# Altium schematic sheet ADCduinoModule_Power.SchDoc: Название платы
size 594 x 420 mm; ApprovedBy: Рогов; CheckedBy: Фамилия проверяющего; DrawnBy: Фамилия разработчика; DocumentNumber: Введите номер платы + Э3; SheetNumber: пусто если листов 1, иначе 1; SheetTotal: количество листов; Format: A2; DocumentType: тип схемы; Title1str: (вторая строка при необходимости); ImagePath: Введите номер платы
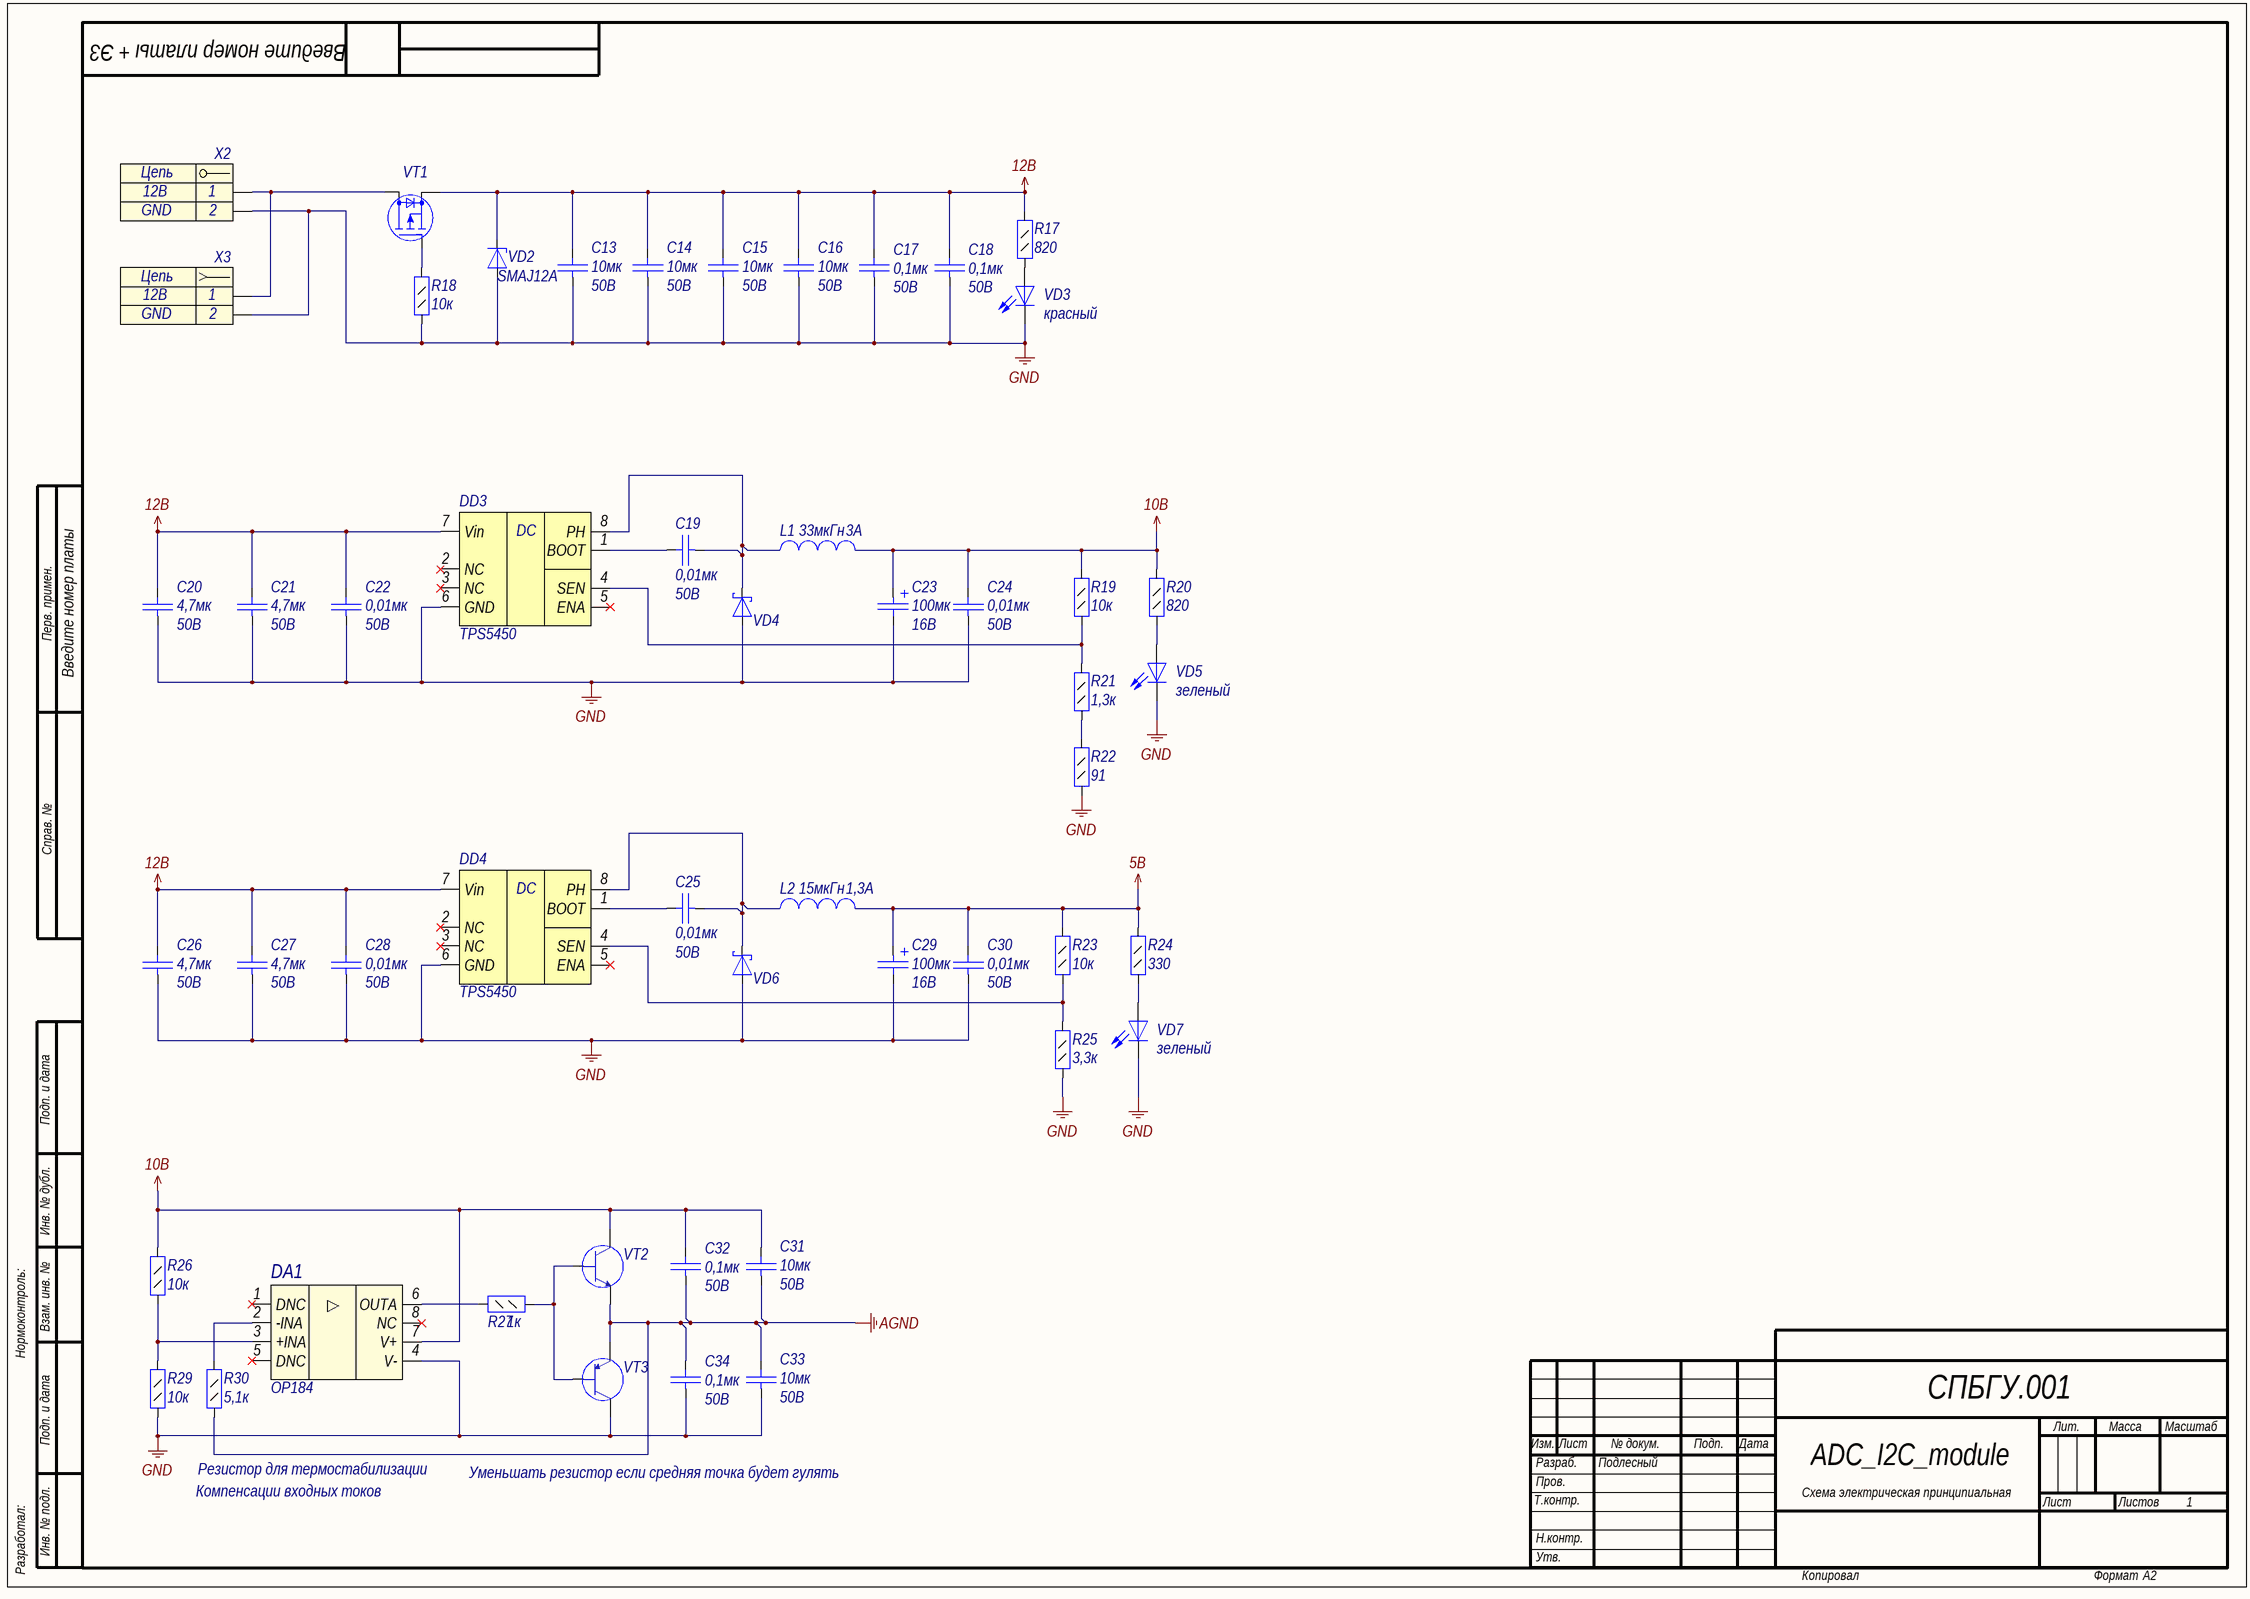
[diagram p0: ADCduinoModule_Power.SchDoc]

## Parts
C13  value 10мк  Voltage: 50В  [C1210]  (hidden comment: Capacitor)
C14  value 10мк  Voltage: 50В  [C1210]  (hidden comment: Capacitor)
C15  value 10мк  Voltage: 50В  [C1210]  (hidden comment: Capacitor)
C16  value 10мк  Voltage: 50В  [C1210]  (hidden comment: Capacitor)
C17  value 0,1мк  Voltage: 50B  [C0805]  (hidden comment: Capacitor)
C18  value 0,1мк  Voltage: 50B  [C0805]  (hidden comment: Capacitor)
C19  value 0,01мк  Voltage: 50B  [C0805]  (hidden comment: Capacitor)
C20  value 4,7мк  Voltage: 50В  [C1206]  (hidden comment: Capacitor)
C21  value 4,7мк  Voltage: 50В  [C1206]  (hidden comment: Capacitor)
C22  value 0,01мк  Voltage: 50B  [C0805]  (hidden comment: Capacitor)
C23  value 100мк  Voltage: 16В  [TANTAL CASE D]  (hidden comment: Capacitor_pol)
C24  value 0,01мк  Voltage: 50B  [C0805]  (hidden comment: Capacitor)
C25  value 0,01мк  Voltage: 50B  [C0805]  (hidden comment: Capacitor)
C26  value 4,7мк  Voltage: 50В  [C1206]  (hidden comment: Capacitor)
C27  value 4,7мк  Voltage: 50В  [C1206]  (hidden comment: Capacitor)
C28  value 0,01мк  Voltage: 50B  [C0805]  (hidden comment: Capacitor)
C29  value 100мк  Voltage: 16В  [TANTAL CASE D]  (hidden comment: Capacitor_pol)
C30  value 0,01мк  Voltage: 50B  [C0805]  (hidden comment: Capacitor)
C31  value 10мк  Voltage: 50В  [C1210]  (hidden comment: Capacitor)
C32  value 0,1мк  Voltage: 50B  [C0805]  (hidden comment: Capacitor)
C33  value 10мк  Voltage: 50В  [C1210]  (hidden comment: Capacitor)
C34  value 0,1мк  Voltage: 50B  [C0805]  (hidden comment: Capacitor)
DA1  OP184  [SO8]
DD3  TPS5450  [SO Powerpad8]
DD4  TPS5450  [SO Powerpad8]
L1  value 33мкГн  Rated Current: 3A  [IND_12.8x12.8]  (hidden comment: Inductor)
L2  value 15мкГн  Rated Current: 1,3A  [SDR0604]  (hidden comment: Inductor)
R17  value 820  [R0805]  (hidden comment: Resistor_0,125Вт)
R18  value 10к  [R0805]  (hidden comment: Resistor_0,125Вт)
R19  value 10к  [R0805]  (hidden comment: Resistor_0,125Вт)
R20  value 820  [R0805]  (hidden comment: Resistor_0,125Вт)
R21  value 1,3к  [R0805]  (hidden comment: Resistor_0,125Вт)
R22  value 91  [R0805]  (hidden comment: Resistor_0,125Вт)
R23  value 10к  [R0805]  (hidden comment: Resistor_0,125Вт)
R24  value 330  [R0805]  (hidden comment: Resistor_0,125Вт)
R25  value 3,3к  [R0805]  (hidden comment: Resistor_0,125Вт)
R26  value 10к  [R0805]  (hidden comment: Resistor_0,125Вт)
R27  value 1к  [R0805]  (hidden comment: Resistor_0,125Вт)
R29  value 10к  [R0805]  (hidden comment: Resistor_0,125Вт)
R30  value 5,1к  [R0805]  (hidden comment: Resistor_0,125Вт)
VD2  Part Number: SMAJ12A  [SMA]  (hidden comment: DiodeZener)
VD3  красный  [L_0805]
VD4  DiodeSchottky  [SMA]  (value not drawn)
VD5  зеленый  [L_0805]
VD6  DiodeSchottky  [SMA]  (value not drawn)
VD7  зеленый  [L_0805]
VT1  P-MOSFET  [DPAK]  (value not drawn)
VT2  BJT NPN  [SOT-223]  (value not drawn)
VT3  BJT PNP  [SOT-223]  (value not drawn)
X2  Header_2_trm  [TERMINAL-2WAY-3.5MM]  (value not drawn)
X3  Header_2_sct  [DS-210]  (value not drawn)

## Nets
5B: C29.1 C30.2 L2.2 R23.2 R24.2
10B: C23.1 C24.2 C31.2 C32.2 DA1.7(V+) L1.2 R19.2 R20.2 R26.2 VT2.3
12B: C13.2 C14.2 C15.2 C16.2 C17.2 C18.2 C20.2 C21.2 C22.2 C26.2 C27.2 C28.2 DD3.7(Vin) DD4.7(Vin) R17.2 VD2.1(K) VT1.3(S)
AGND: C31.1 C32.1 C33.2 C34.2 R30.1 VT2.2 VT3.2
GND: C13.1 C14.1 C15.1 C16.1 C17.1 C18.1 C20.1 C21.1 C22.1 C23.2 C24.1 C26.1 C27.1 C28.1 C29.2 C30.1 C33.1 C34.1 DA1.4(V-) DD3.6(GND) DD4.6(GND) R18.1 R22.1 R25.1 R29.1 VD2.2(A) VD3.1(K) VD4.2(A) VD5.1(K) VD6.2(A) VD7.1(K) VT3.3 X2.2 X3.2
NetC19_1: C19.1 DD3.8(PH) L1.1 VD4.1(K)
NetC19_2: C19.2 DD3.1(BOOT)
NetC25_1: C25.1 DD4.8(PH) L2.1 VD6.1(K)
NetC25_2: C25.2 DD4.1(BOOT)
NetDA1_2: DA1.2(-INA) R30.2
NetDA1_3: DA1.3(+INA) R26.1 R29.2
NetDA1_6: DA1.6(OUTA) R27.1
NetDD3_4: DD3.4(SEN) R19.1 R21.2
NetDD4_4: DD4.4(SEN) R23.1 R25.2
NetR17_1: R17.1 VD3.2(A)
NetR18_2: R18.2 VT1.1(G)
NetR20_1: R20.1 VD5.2(A)
NetR21_1: R21.1 R22.2
NetR24_1: R24.1 VD7.2(A)
NetR27_2: R27.2 VT2.1 VT3.1
NetVT1_2: VT1.2(D) X2.1 X3.1

Not connected (* = marked no-connect by the designer): DA1 1(DNC)* 5(DNC)* 8(NC)*; DD3 2(NC)* 3(NC)* 5(ENA)*; DD4 2(NC)* 3(NC)* 5(ENA)*

## Notes on the sheet
- Перв. примен.
- Справ. №
- Подп. и дата
- Инв. № дубл.
- Нормоконтроль:
- Взам. инв. №
- СПБГУ.001
- Изм.
- Лист
- № докум.
- Подп.
- Дата
- Лит.
- Масса
- Масштаб
- Компенсации входных токов
- Резистор для термостабилизации
- Уменьшать резистор если средняя точка будет гулять
- Т.контр.
- Пров.
- Разраб.
- Подлесный
- Схема электрическая принципиальная
- ADC_I2C_module
- Листов
- 1
- Разработал:
- Инв. № подл.
- Н.контр.
- Утв.
- Копировал
- Формат
- (in symbol connect1) Цепь
- (in symbol connect34) Цепь
- (in symbol pwr12) DC

## Library data of the parts
C13-C16 C31 C33 = cap205: Конденсатор; Part Name: Ceramic; Manufacture: Murata; Part Number: GRM32ER71H106K; id: cap205; TKE: X7R
C17 C18 C32 C34 = cap141: Конденсатор; Part Name: Ceramic; Manufacture: Murata; Part Number: GRM21BR71H104K**; id: cap141; TKE: X7R
C19 C22 C24 C25 C28 C30 = cap136: Конденсатор; Part Name: Ceramic; Manufacture: Murata; Part Number: GRM216R71H103K; id: cap136; TKE: X7R
C20 C21 C26 C27 = cap188: Конденсатор; Part Name: Ceramic; Manufacture: Murata; Part Number: GRM31CR71H475KA12L; id: cap188; TKE: X7R
C23 C29 = cap209: Конденсатор полярный; Part Name: Tantal; Manufacture: Vishay; Part Number: 293D107X9016D2TE3; id: cap209
DA1 = amp16: Precision Rail-to-Rail / Input and Output Operational Amplifiers; Part Number: OP184ESZ; Manufacture: Analog Devices; id: amp16; Rail-to-rail: yes; Supply Voltage: 3-36B; Supply Current max: 1,45mA; Bandwidth: 3,25MHz; Input Bias Current: 60nA; CMRR: 86dB; PSRR: 76dB; Offset voltage: 165uB; Channels: 1; Part Name: Precision Rail-to-Rail Input and Output
DD3 DD4 = pwr12: 5-A, Wide Input Range, Step-Down Converter; Manufacturer: Texas Instruments; id: pwr12; Input Voltage: 5,5 - 36B; Output Voltage: Adj; Current: 5A; Part Name: Step-Down Converter; Type: Impulse; Part Number: TPS5450
L1 = ind80: EMI Suppression Filter; Part Name: SMD Power Inductors; Part Number: B82477G4333M000; Manufacture: Epcos; id: ind80; Saturation Current: 3,5A; Resistance: 0,053Ohm
L2 = ind44: EMI Suppression Filter; Part Name: SMD Power Inductors; Part Number: SDR0604- 150YL; Manufacture: Bourns; id: ind44; Saturation Current: 1,6A; Resistance: 0,14Ohm
R17 R20 = res71: Резистор; Manufacture: Yageo; Part Number: RC0805FR-07820RL; id: res71; Accuracy: 0,01; Part Name: Resistor; Power: 0,125Вт
R18 R19 R23 R26 R29 = res97: Резистор; Manufacture: Yageo; Part Number: RC0805FR-0710KL; id: res97; Accuracy: 0,01; Part Name: Resistor; Power: 0,125Вт
R21 = res76: Резистор; Manufacture: Yageo; Part Number: RC0805FR-071K3; id: res76; Accuracy: 0,01; Part Name: Resistor; Power: 0,125Вт
R22 = res48: Резистор; Manufacture: Yageo; Part Number: RC0805FR-0791RL; id: res48; Accuracy: 0,01; Part Name: Resistor; Power: 0,125Вт
R24 = res61: Резистор; Manufacture: Yageo; Part Number: RC0805FR-07330RL; id: res61; Accuracy: 0,01; Part Name: Resistor; Power: 0,125Вт
R25 = res85: Резистор; Manufacture: Yageo; Part Number: RC0805FR-072K3; id: res85; Accuracy: 0,01; Part Name: Resistor; Power: 0,125Вт
R27 = res73: Резистор; Manufacture: Yageo; Part Number: RC0805FR-071KL; id: res73; Accuracy: 0,01; Part Name: Resistor; Power: 0,125Вт
R30 = res90: Резистор; Manufacture: Yageo; Part Number: RC0805FR-075K1; id: res90; Accuracy: 0,01; Part Name: Resistor; Power: 0,125Вт
VD2 = SMAJ12A: Cтабилитрон (лавинный выпрямительный диод) односторонний; Part Name: TVS diode Unidirectional; Manufacture: ST Microelectronics; id: tvs128; Leakage Current: 0,2uA; Stand-off Voltage: 12B; Breakdown Voltage: 14B; Clamping voltage: 19,9B; Dynamic resistance: 0,259Ohm; Peak Pulse Power: 400W; Number of diodes: 1
VD3 = diode5: Светодиод; Part Number: KP-2012EC; id: diode5; Part Name: LED
VD4 VD6 = diode1: Диод Шоттки; Part Number: SK34A; Manufacture: Taiwan Semiconductor; id: diode1; Max Reverse Voltage: 40B; Forward Voltage: 0,55B; Forward Current: 3A; Part Name: Diode Schottky
VD5 VD7 = diode5: Светодиод; Part Number: KP-2012MGC; id: diode5; Part Name: LED
VT1 = trans8: N-MOSFET; Part Number: FDD6637; Manufacturer: Fairchild Semiconductor; id: trans8; Structure: p-channel; V drain-source max: (-35B); Rds: 0,0116Ohm; Gate-to-source voltage: (+-)25B; Continuous drain current: (-55)A; Pulsed drain current: (-100)A; Power dissipation: 57W
VT2 = bjt3: Part Name: Transistor; Part Number: PBSS4540Z.115; Manufacture: NXP Semiconductor; id: bjt3; hfe: 300; Vceo max: 40В; Ic max: 5А; Power: 2Вт; Frequency: 130МГц; Structure: npn
VT3 = bjt4: Part Name: Transistor; Part Number: PBSS5540Z.115; Manufacture: NXP Semiconductor; id: bjt4; hfe: 300; Vceo max: 40В; Ic max: 5А; Power: 2Вт; Frequency: 130МГц; Structure: pnp
X2 = connect34: Разъем - 2 конт. клеммник; Part Name: TERMINAL BLOCK 2 way; Contact_1: 12B; Contact_2: GND; Etch: 3.5mm; id: connect34
X3 = connect1: Разъем - 2 конт. розетка; Part Name: DC Power Jack; Part Number: DS-210B(PBT)(NB); Contact_1: 12B; Contact_2: GND; id: connect1